# Altium schematic sheet stepUp.SchDoc: Pickit 2
size 146 x 96 mm; SheetNumber: 3; SheetTotal: 3; PageSetup: Record=PageOptions|CenterHorizontal=True|CenterVertical=True|PrintScale=2.00|XCorrection=1.00|YCorrection=1.00|PrintKind=0|BorderSize=5000000|LeftOffset=0|BottomOffset=0|Orientation=2|PaperLength=1000|PaperWidth=1000|Scale=100|PaperSource=7|PrintQuality=-4|MediaType=1|DitherType=10|PaperKind=A4|PrintScaleMode=1
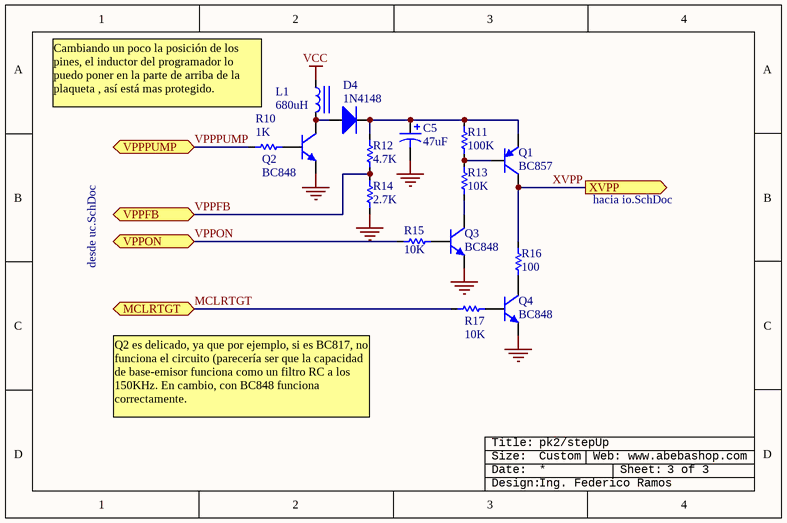
[diagram p0: stepUp.SchDoc]

## Parts
C5  47uF  [D]
D4  1N4148  [DSMD1MM]
L1  value 680uH  [RES300TH]
Q1  BC857  [SOT23]
Q2  BC848  [SOT23]
Q3  BC848  [SOT23]
Q4  BC848  [SOT23]
R10  value 1K  [1206NP]  (hidden comment: Res)
R11  value 100K  [1206NP]  (hidden comment: Res)
R12  value 4.7K  [1206NP]  (hidden comment: Res)
R13  value 10K  [1206NP]  (hidden comment: Res)
R14  value 2.7K  [1206NP]  (hidden comment: Res)
R15  value 10K  [1206NP]  (hidden comment: Res)
R16  value 100  [1206NP]  (hidden comment: Res)
R17  value 10K  [1206NP]  (hidden comment: Res)
ROT?  Rotulo  (value not drawn)  (graphical)

## Ports
MCLRTGT (bidir), VPPFB (bidir), VPPON (bidir), VPPPUMP (bidir), XVPP (out)

## Nets
GND: C5.2 Q2.3(E) Q3.3(E) Q4.3(E) R14.1
VCC: L1.1
MCLRTGT: R17.2 ; port MCLRTGT
VPPFB: R12.1 R14.2 ; port VPPFB
VPPON: R15.2 ; port VPPON
VPPPUMP: R10.2 ; port VPPPUMP
XVPP: Q1.1(C) R16.2 ; port XVPP
NetC5_1: C5.1 D4.2 Q1.3(E) R11.2 R12.2
NetD4_1: D4.1 L1.2 Q2.1(C)
NetQ1_2: Q1.2(B) R11.1 R13.2
NetQ2_2: Q2.2(B) R10.1
NetQ3_1: Q3.1(C) R13.1
NetQ3_2: Q3.2(B) R15.1
NetQ4_1: Q4.1(C) R16.1
NetQ4_2: Q4.2(B) R17.1

## Notes on the sheet
- Cambiando un poco la posición de los pines, el inductor del programador lo puedo poner en la parte de arriba de la plaqueta , así está mas protegido.
- hacia io.SchDoc
- desde uc.SchDoc
- Q2 es delicado, ya que por ejemplo, si es BC817, no funciona el circuito (parecería ser que la capacidad de base-emisor funciona como un filtro RC a los 150KHz. En cambio, con BC848 funciona correctamente.
- pk2/stepUp
- Custom
- (near ROT?) 3 of 3
- Ing. Federico Ramos
- (in symbol Rotulo) Title:; Size:; Web: www.abebashop.com; Date:; Sheet:; Design:

## Library data of the parts
C5 = T491D: Solid Tantalum Chip Capacitor, Standard T491 Series - Industrial Grade; Value: 100pF; Published: 17-Jul-2002; LatestRevisionDate: 19-Mar-2004; LatestRevisionNote: Silkscreen dimensions re-sized.; DatasheetDocument: Mar-2001; PackageDocument: Mar-2001; PackageReference: D; Publisher: Altium Limited; Code_JEITA: 7343-31; ComponentLink1Description: Manufacturer Link; ComponentLink1URL: http://www.kemet.com/; ComponentLink2Description: Datasheet; ComponentLink2URL: http://www.kemet.com/kemet/web/homepage/kechome.nsf/vapubfilesname/F3102TA.pdf/$file/F3102TA.pdf
D4 = 1N4148: High Conductance Fast Diode; Price: ?
L1 = Inductor: Revision: July-2002: Re-released for DXP Platform.
Q1 = BC856A: 100mA 65V PNP Bipolar Transistor; pin to pad: 1>3 2>1 3>2; Price: 0.3267
Q2-Q4 = BC846A: 100mA 65V NPN Bipolar Transistor; pin to pad: 1>3 2>1 3>2; Price: 0.38
R10-R17 = Res: Resistor; Power: 0.25W; Price: 0.036
ROT? = Rotulo: Rotulo [consolas]